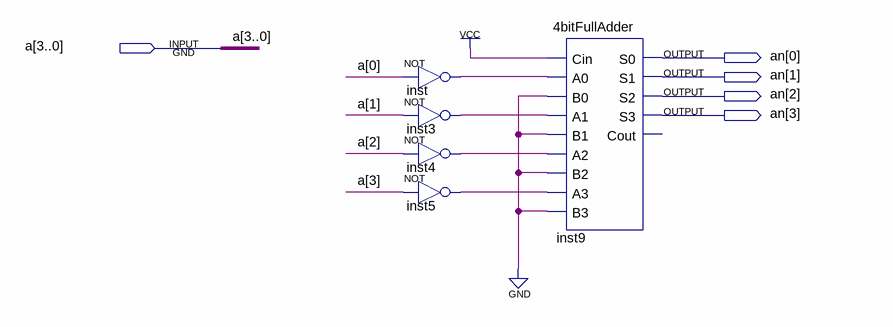
[diagram p0: schematic sheet]
// Quartus schematic negative.bdf as structural Verilog: 5 symbols, 5 pins
module negative (
  input  [3:0] a,
  output [3:0] an
);

  wire inst3_out, inst4_out, inst5_out, inst_out;

  not inst (inst_out, a[0]);
  not inst3 (inst3_out, a[1]);
  not inst4 (inst4_out, a[2]);
  not inst5 (inst5_out, a[3]);
  \4bitFullAdder  inst9 (
    .Cin(1'b1), .A0(inst_out), .B0(1'b0), .A1(inst3_out), .B1(1'b0), .A2(inst4_out), .B2(1'b0),
    .A3(inst5_out), .B3(1'b0), .S0(an[0]), .S1(an[1]), .S2(an[2]), .S3(an[3]));  // open: Cout
endmodule
